# Altium schematic sheet 外围电路.SchDoc
size A4
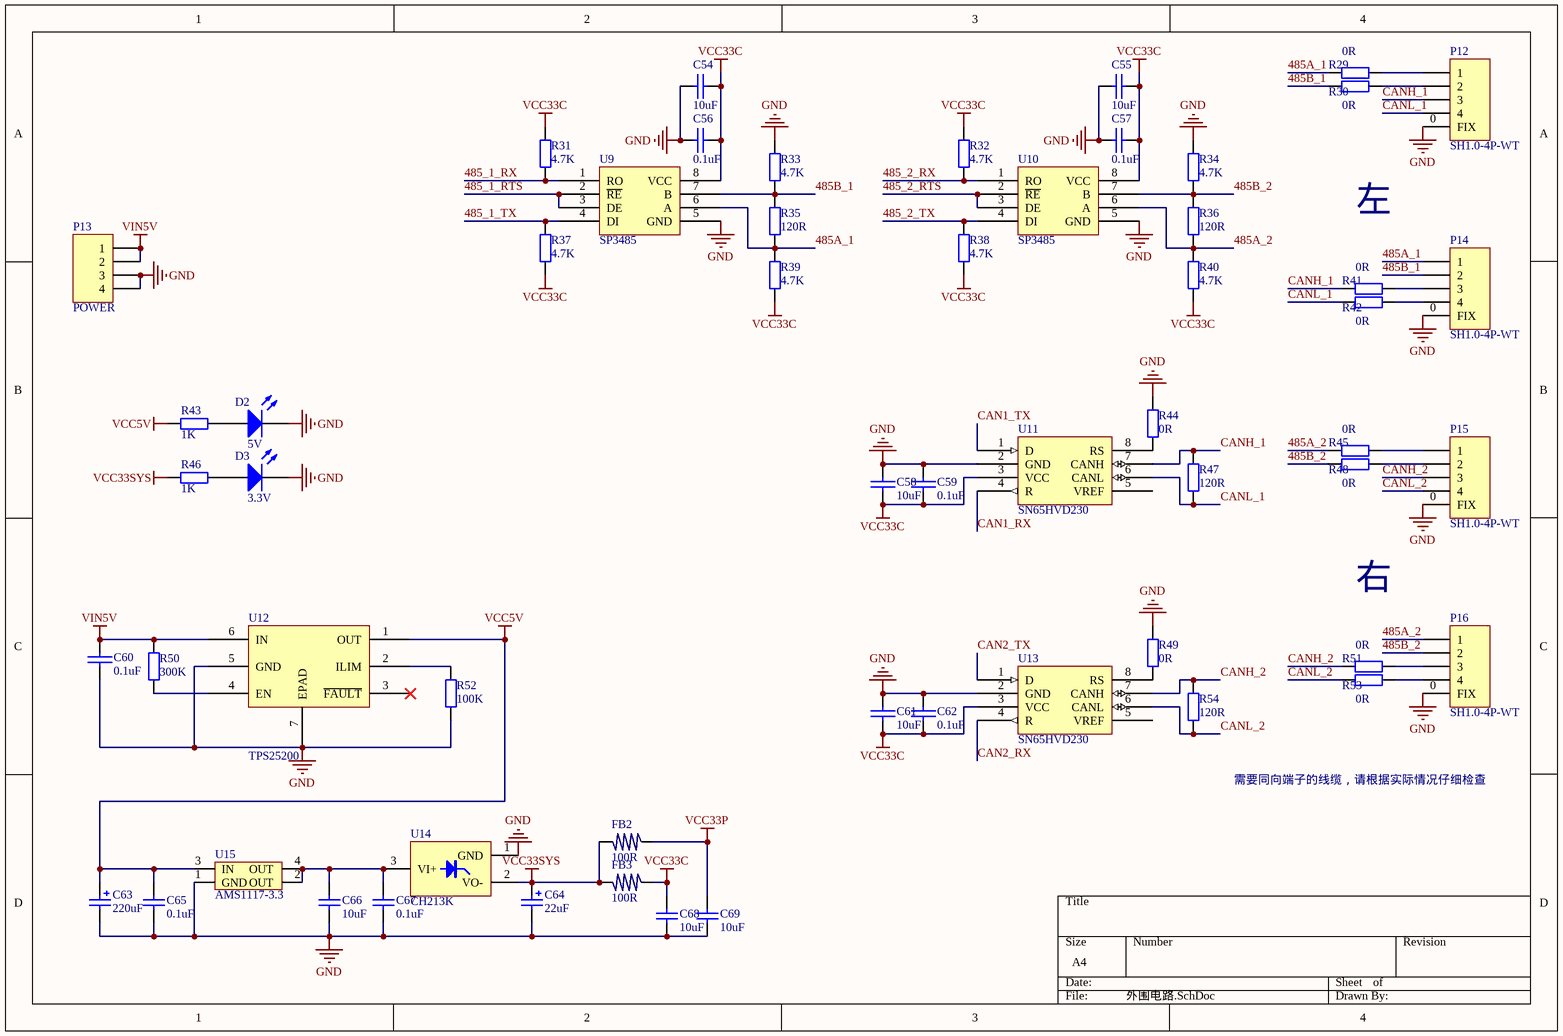
[diagram p0: 外围电路.SchDoc]

## Parts
C54  10uF  [C0805_M]
C55  10uF  [C0805_M]
C56  0.1uF  [C0805_M]
C57  0.1uF  [C0805_M]
C58  10uF  [C0805_M]
C59  0.1uF  [C0805_M]
C60  0.1uF  [C0805_M]
C61  10uF  [C0805_M]
C62  0.1uF  [C0805_M]
C63  220uF  [CS 6*6 - R]
C64  22uF  [CS 6*6 - R]
C65  0.1uF  [C0805_M]
C66  10uF  [C0805_M]
C67  0.1uF  [C0805_M]
C68  10uF  [C0805_M]
C69  10uF  [C0805_M]
D2  5V  [LED0805_G]
D3  3.3V  [LED0805_G]
FB2  100R  [R0805_M]
FB3  100R  [R0805_M]
P12  SH1.0-4P-WT  [SH1.0-LT-4P]
P13  POWER  [XH2.54-LI-4P]
P14  SH1.0-4P-WT  [SH1.0-LT-4P]
P15  SH1.0-4P-WT  [SH1.0-LT-4P]
P16  SH1.0-4P-WT  [SH1.0-LT-4P]
R29  0R  [R0805_M]
R30  0R  [R0805_M]
R31  4.7K  [R0805_M]
R32  4.7K  [R0805_M]
R33  4.7K  [R0805_M]
R34  4.7K  [R0805_M]
R35  120R  [R0805_M]
R36  120R  [R0805_M]
R37  4.7K  [R0805_M]
R38  4.7K  [R0805_M]
R39  4.7K  [R0805_M]
R40  4.7K  [R0805_M]
R41  0R  [R0805_M]
R42  0R  [R0805_M]
R43  1K  [R0805_M]
R44  0R  [R0805_M]
R45  0R  [R0805_M]
R46  1K  [R0805_M]
R47  120R  [R0805_M]
R48  0R  [R0805_M]
R49  0R  [R0805_M]
R50  300K  [R0805_M]
R51  0R  [R0805_M]
R52  100K  [R0805_M]
R53  0R  [R0805_M]
R54  120R  [R0805_M]
U9  SP3485  [SOIC-8]
U10  SP3485  [SOIC-8]
U11  SN65HVD230  [SOIC-8]
U12  TPS25200  [WSON-6]
U13  SN65HVD230  [SOIC-8]
U14  CH213K  [SOT-23-3]
U15  AMS1117-3.3  [SOT223_M]

## Nets
GND: C54.1 C55.1 C56.1 C57.1 C58.2 C59.2 C60.2 C61.2 C62.2 C63.2 C64.2 C65.1 C66.1 C67.1 C68.1 C69.1 D2.2(K) D3.2(K) P12.0(FIX) P13.3 P13.4 P14.0(FIX) P15.0(FIX) P16.0(FIX) R33.2 R34.2 R44.2 R49.2 R52.1 U9.5(GND) U10.5(GND) U11.2(GND) U12.5(GND) U12.7(EPAD) U13.2(GND) U14.1(GND) U15.1(GND)
VCC5V: C63.1 C65.2 R43.2 U12.1(OUT) U15.3(IN)
VCC33C: C54.2 C55.2 C56.2 C57.2 C58.1 C59.1 C61.1 C62.1 C68.2 FB3.1 R31.2 R32.2 R37.1 R38.1 R39.1 R40.1 U9.8(VCC) U10.8(VCC) U11.3(VCC) U13.3(VCC)
VCC33P: C69.2 FB2.1
VCC33SYS: C64.1 FB2.2 FB3.2 R46.2 U14.2(VO-)
VIN5V: C60.1 P13.1 P13.2 R50.2 U12.6(IN)
485_1_RTS: U9.2(~{RE}) U9.3(DE)
485_1_RX: R31.1 U9.1(RO)
485_1_TX: R37.2 U9.4(DI)
485_2_RTS: U10.2(~{RE}) U10.3(DE)
485_2_RX: R32.1 U10.1(RO)
485_2_TX: R38.2 U10.4(DI)
485A_1: P14.1 R29.2 R35.1 R39.2 U9.6(A)
485A_2: P16.1 R36.1 R40.2 R45.2 U10.6(A)
485B_1: P14.2 R30.2 R33.1 R35.2 U9.7(B)
485B_2: P16.2 R34.1 R36.2 R48.2 U10.7(B)
CAN1_RX: U11.4(R)
CAN1_TX: U11.1(D)
CAN2_RX: U13.4(R)
CAN2_TX: U13.1(D)
CANH_1: P12.3 R41.2 R47.2 U11.7(CANH)
CANH_2: P15.3 R51.2 R54.2 U13.7(CANH)
CANL_1: P12.4 R42.2 R47.1 U11.6(CANL)
CANL_2: P15.4 R53.2 R54.1 U13.6(CANL)
NetC66_2: C66.2 C67.2 U14.3(VI+) U15.2(OUT) U15.4(OUT)
NetD2_1: D2.1(A) R43.1
NetD3_1: D3.1(A) R46.1
NetP12_1: P12.1 R29.1
NetP12_2: P12.2 R30.1
NetP14_3: P14.3 R41.1
NetP14_4: P14.4 R42.1
NetP15_1: P15.1 R45.1
NetP15_2: P15.2 R48.1
NetP16_3: P16.3 R51.1
NetP16_4: P16.4 R53.1
NetR44_1: R44.1 U11.8(RS)
NetR49_1: R49.1 U13.8(RS)
NetR50_1: R50.1 U12.4(EN)
NetR52_2: R52.2 U12.2(ILIM)

Not connected (* = marked no-connect by the designer): U11 5(VREF); U12 3(~{FAULT})*; U13 5(VREF)

## Notes on the sheet
- 左
- 右
- 需要同向端子的线缆，请根据实际情况仔细检查

## Library data of the parts
C54-C62 = CAP: Capacitor
C63 C64 = Cap Pol2: Polarized Capacitor (Axial); Value: 100pF; Published: 8-Jun-2000; LatestRevisionDate: 17-Jul-2002; LatestRevisionNote: Re-released for DXP Platform.; PackageReference: POLAR0.8; Publisher: Altium Limited; PackageDescription: Polarized Capacitor; 2 Leads
C65-C69 = Cap: Capacitor; Value: 100pF; Published: 8-Jun-2000; LatestRevisionDate: 17-Jul-2002; LatestRevisionNote: Re-released for DXP Platform.; PackageReference: RAD-0.3; Publisher: Altium Limited; PackageDescription: Radial Cap, Thru-Hole; 2 Leads; 0.3 in Pin Spacing
D2 D3 = LED1: Typical RED GaAs LED; Published: 8-Jun-2000; LatestRevisionDate: 08-Jul-2005; LatestRevisionNote: Mech Layer 1 removed.; PackageReference: LED-1; Publisher: Altium Limited; PackageDescription: LED; 2 Leads
FB2 FB3 = L
P12 P14-P16 = Header 5: Header, 5-Pin; LatestRevisionDate: 17-Jul-2002; LatestRevisionNote: Re-released for DXP Platform.; Publisher: Altium Limited
P13 = Header 4: Header, 4-Pin; LatestRevisionDate: 17-Jul-2002; LatestRevisionNote: Re-released for DXP Platform.; Publisher: Altium Limited
R29-R42 R44 R45 R47-R54 = Res2: Resistor; Value: 1K; Published: 8-Jun-2000; LatestRevisionDate: 17-Jul-2002; LatestRevisionNote: Re-released for DXP Platform.; PackageReference: AXIAL-0.4; Publisher: Altium Limited; PackageDescription: Axial Device, Thru-Hole; 2 Leads; 0.4 in Pin Spacing
R43 R46 = Res2: Resistor; Published: 8-Jun-2000; LatestRevisionDate: 17-Jul-2002; LatestRevisionNote: Re-released for DXP Platform.; PackageReference: AXIAL-0.4; Publisher: Altium Limited; PackageDescription: Axial Device, Thru-Hole; 2 Leads; 0.4 in Pin Spacing; Value: 1K
U11 U13 = SN65HVD230/1
U14 = CH213K: Ideal Diode 5V*1A
U15 = AMS1117